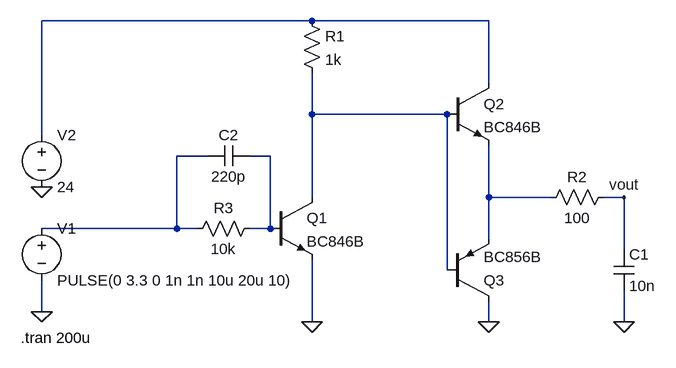
[diagram p0: schematic discrete_MOSFET-driver.asc]
discrete_MOSFET-driver.asc, the LTspice schematic file:
Version 4
SHEET 1 880 680
WIRE 96 -144 -320 -144
WIRE 368 -144 96 -144
WIRE 368 -48 368 -144
WIRE 96 0 96 -64
WIRE 304 0 96 0
WIRE -320 32 -320 -144
WIRE -64 64 -112 64
WIRE 32 64 0 64
WIRE 96 128 96 0
WIRE 368 128 368 48
WIRE 464 128 368 128
WIRE 576 128 544 128
WIRE -112 176 -112 64
WIRE -112 176 -320 176
WIRE -80 176 -112 176
WIRE 32 176 32 64
WIRE 32 176 0 176
WIRE 368 192 368 128
WIRE 576 208 576 128
WIRE 304 240 304 0
WIRE -320 304 -320 256
WIRE 96 320 96 224
WIRE 368 320 368 288
WIRE 576 320 576 272
FLAG -320 304 0
FLAG 96 320 0
FLAG 368 320 0
FLAG 576 320 0
FLAG -320 112 0
FLAG 576 128 vout
SYMBOL voltage -320 160 R0
WINDOW 123 0 0 Left 0
WINDOW 39 0 0 Left 0
SYMATTR InstName V1
SYMATTR Value PULSE(0 3.3 0 1n 1n 10u 20u 10)
SYMBOL voltage -320 16 R0
WINDOW 123 0 0 Left 0
WINDOW 39 0 0 Left 0
SYMATTR InstName V2
SYMATTR Value 24
SYMBOL npn 32 128 R0
SYMATTR InstName Q1
SYMATTR Value BC846B
SYMBOL npn 304 -48 R0
SYMATTR InstName Q2
SYMATTR Value BC846B
SYMBOL pnp 304 288 M180
SYMATTR InstName Q3
SYMATTR Value BC856B
SYMBOL cap 560 208 R0
SYMATTR InstName C1
SYMATTR Value 10n
SYMBOL res 80 -160 R0
SYMATTR InstName R1
SYMATTR Value 1k
SYMBOL res 560 112 R90
WINDOW 0 0 56 VBottom 2
WINDOW 3 32 56 VTop 2
SYMATTR InstName R2
SYMATTR Value 100
SYMBOL res 16 160 R90
WINDOW 0 0 56 VBottom 2
WINDOW 3 32 56 VTop 2
SYMATTR InstName R3
SYMATTR Value 10k
SYMBOL cap 0 48 R90
WINDOW 0 0 32 VBottom 2
WINDOW 3 32 32 VTop 2
SYMATTR InstName C2
SYMATTR Value 220p
TEXT -352 344 Left 2 !.tran 200u

The netlist it stands for:
* discrete_MOSFET-driver.asc
V1 N003 0 PULSE(0 3.3 0 1n 1n 10u 20u 10)
V2 N001 0 24
Q1 N002 N004 0 0 BC846B
Q2 N001 N002 N005 0 BC846B
Q3 0 N002 N005 0 BC856B
C1 vout 0 10n
R1 N001 N002 1k
R2 vout N005 100
R3 N004 N003 10k
C2 N004 N003 220p
.model NPN NPN
.model PNP PNP
.lib standard.bjt
.tran 200u
.backanno
.end